# EAGLE schematic knxhome-lqfp32 (EAGLE 9.3.1)
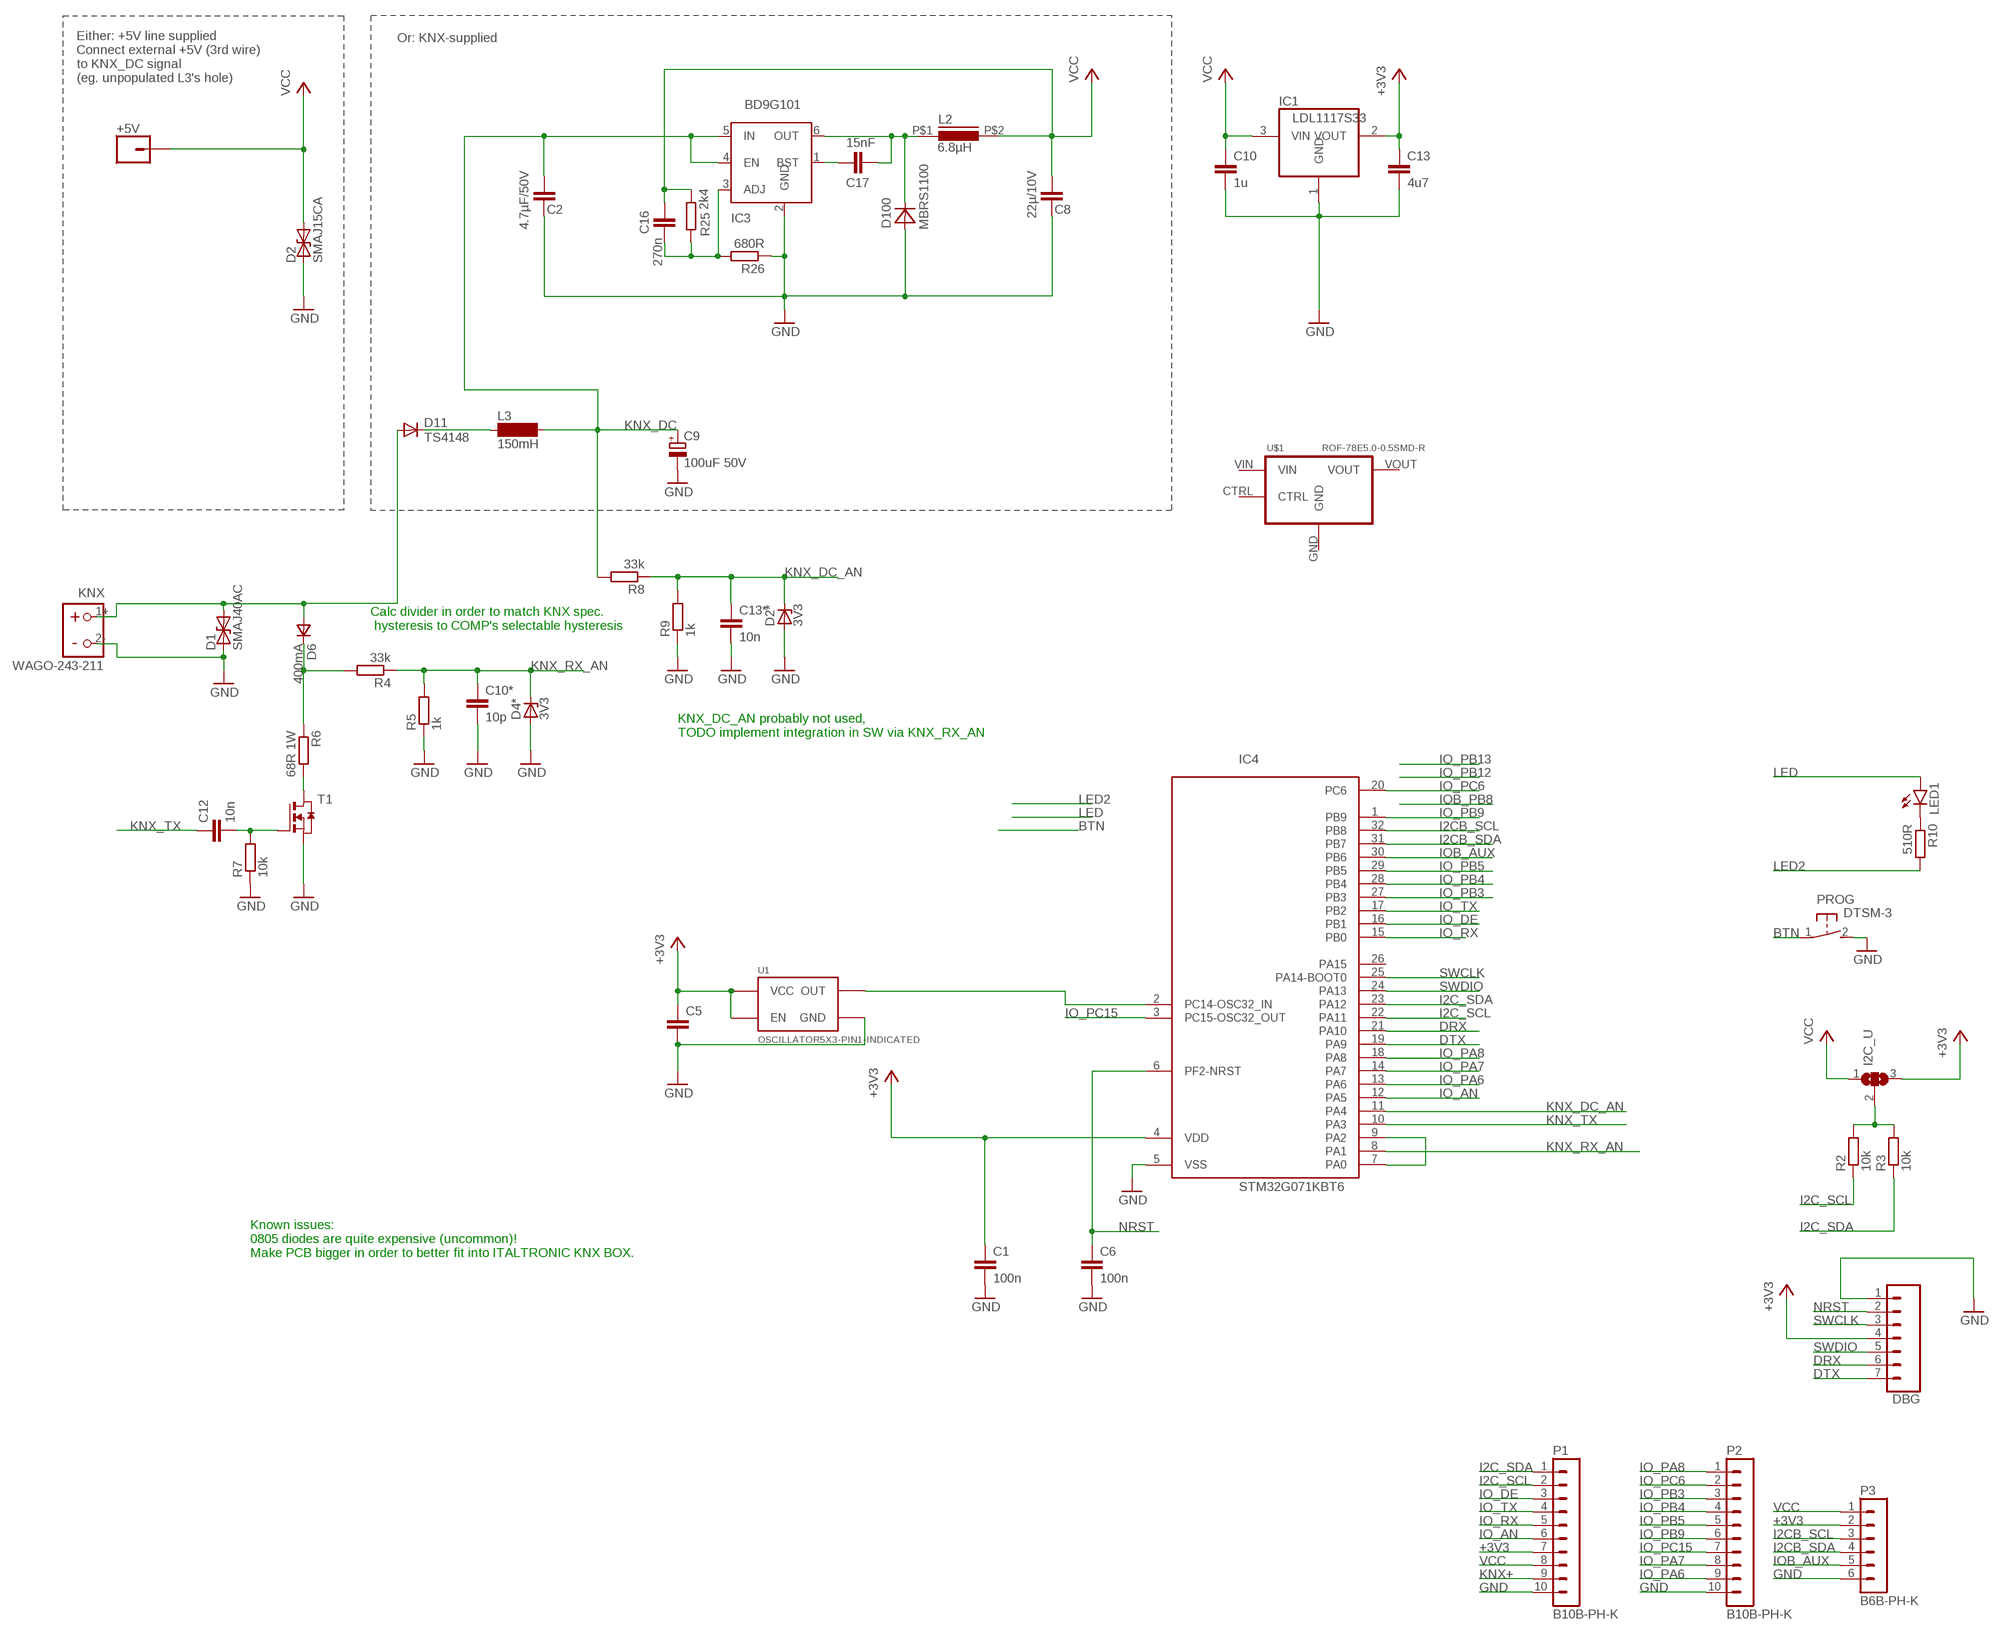
[diagram p0: schematic, sheet 1]

## Parts
+5V  CONN_01PTH_LONGPAD  [1X01_LONGPAD]
C1  100n  C-EUC0805  [C0805]
C2  4.7µF/50V  C-EUC0805  [C0805]
C5  C-EUC0805  [C0805]
C6  100n  C-EUC0805  [C0805]
C8  22µ/10V  C-EUC0805  [C0805]
C9  100uF 50V  CPOL-EUE3.5-8  [E3,5-8]
C10  1u  C-EUC0805  [C0805]
C10*  10p  C-EUC0805  [C0805]
C12  10n  C-EUC0805  [C0805]
C13  4u7  C-EUC0805  [C0805]
C13*  10n  C-EUC0805  [C0805]
C16  270n  C-EUC0805  [C0805]
C17  15nF  C-EUC0805  [C0805]
D1  SMAJ40AC  [DO-214AC]
D2  SMAJ15CA  SMAJ40AC  [DO-214AC]
D2*  3V3  ZENER-DIODESOT23  [SOT23]
D4*  3V3  ZENER-DIODESOT23  [SOT23]
D6  400mA  DSOD323  [SOD323]
D11  TS4148  DIODE-D0805  [D0805]
D100  MBRS1100  MBRA340T3  [SMA]
DBG  CONN_07LOCK  [1X07_LOCK]
I2C_U  SJ2W  [SJ_2]
IC1  LDL1117S33  REG1117  [SOT223]
IC3  BD9G101  BD9G101GBD9G101G-SOT23-6  [SOT23-6]
IC4  STM32G071KBT6  [LQFP32]
KNX  WAGO-243-211  [WAGO-243-211]
L2  6.8µH  IND_FASTRON_1616FPS  [PIS2812]
L3  150mH  SD12BS11_LIEGEND  [BS11_LIEGEND]
LED1  LEDCHIP-LED0805  [CHIP-LED0805]
P1  B10B-PH-K  [B10B-PH-K]
P2  B10B-PH-K  [B10B-PH-K]
P3  B6B-PH-K  [B6B-PH-K]
PROG  DTSM-3  [DTSM-3]
R2  10k  R-EU_R0805  [R0805]
R3  10k  R-EU_R0805  [R0805]
R4  33k  R-EU_R0805  [R0805]
R5  1k  R-EU_R0805  [R0805]
R6  68R 1W  R-EU_R2512  [R2512]
R7  10k  R-EU_R0805  [R0805]
R8  33k  R-EU_R0805  [R0805]
R9  1k  R-EU_R0805  [R0805]
R10  510R  R-EU_R0805  [R0805]
R25  2k4  R-EU_R0805  [R0805]
R26  680R  R-EU_R0805  [R0805]
T1  NMOSSOT23  [SOT-23]
U1  OSCILLATOR5X3-PIN1-INDICATED  [CRYSTAL-OSC-SMD-5X3]
U$1  ROF-78E5.0-0.5SMD-R  [ROF-78EX-XSMD-R]

## Nets
+3V3: C1.1 C5.1 C13.1 DBG.4 I2C_U.3 IC1.2(VOUT) IC4.4(VDD) P1.7 P3.2 U1.1(EN) U1.4(VCC)
ADJ: C16.1 IC3.3(ADJ) R25.1 R26.2
BTN: PROG.1
DRX: DBG.6 IC4.21(PA10)
DTX: DBG.7 IC4.19(PA9)
GND: C1.2 C2.1 C5.2 C6.2 C8.1 C9.- C10*.2 C10.2 C13*.2 C13.2 D1.A D2*.1(A) D2.A D4*.1(A) D100.A DBG.1 IC1.1(GND) IC3.2(GND) IC4.5(VSS) KNX.2- P1.10 P2.10 P3.6 PROG.2 R5.1 R7.1 R9.1 R26.1 T1.2(S) U1.2(GND)
I2C_PUP: I2C_U.2 R2.2 R3.2
I2C_SCL: IC4.22(PA11) P1.2 R2.1
I2C_SDA: IC4.23(PA12) P1.1 R3.1
I2CB_SCL: IC4.32(PB8) P3.3
I2CB_SDA: IC4.31(PB7) P3.4
IO_AN: IC4.12(PA5) P1.6
IO_DE: IC4.16(PB1) P1.3
IO_PA6: IC4.13(PA6) P2.9
IO_PA7: IC4.14(PA7) P2.8
IO_PA8: IC4.18(PA8) P2.1
IO_PB3: IC4.27(PB3) P2.3
IO_PB4: IC4.28(PB4) P2.4
IO_PB5: IC4.29(PB5) P2.5
IO_PB9: IC4.1(PB9) P2.6
IO_PC6: IC4.20(PC6) P2.2
IO_PC15: IC4.3(PC15-OSC32_OUT) P2.7
IO_RX: IC4.15(PB0) P1.5
IO_TX: IC4.17(PB2) P1.4
IOB_AUX: IC4.30(PB6) P3.5
KNX+ [power]: D1.C D6.2(A) D11.A KNX.1+ P1.9
KNX_DC: C2.2 C9.+ IC3.4(EN) IC3.5(IN) L3.2 R8.2
KNX_DC_AN: C13*.1 D2*.3(C) IC4.11(PA4) R8.1 R9.2
KNX_RECT: D6.1(C) R4.2 R6.1
KNX_RX_AN: C10*.1 D4*.3(C) IC4.8(PA1) R4.1 R5.2
KNX_TX: C12.1 IC4.10(PA3)
LED: LED1.A
LED2: R10.2
LX: C17.1 D100.C IC3.6(OUT) L2.P$1
N$1: D11.C L3.1
N$4: LED1.C R10.1
N$5: IC4.7(PA0) IC4.9(PA2)
N$7: R6.2 T1.1(D)
N$8: C12.2 R7.2 T1.3(G)
N$19: C17.2 IC3.1(BST)
NRST: C6.1 DBG.2 IC4.6(PF2-NRST)
OSC: IC4.2(PC14-OSC32_IN) U1.3(OUT)
SWCLK: DBG.3 IC4.25(PA14-BOOT0)
SWDIO: DBG.5 IC4.24(PA13)
VCC: +5V.1 C8.2 C10.1 C16.2 D2.C I2C_U.1 IC1.3(VIN) L2.P$2 P1.8 P3.1 R25.2
Unconnected: IC4.26(PA15) U$1.CTRL U$1.GND U$1.VIN U$1.VOUT

## Notes on the sheet
- Or: KNX-supplied
- Either: +5V line supplied
  Connect external +5V (3rd wire)
  to KNX_DC signal 
  (eg. unpopulated L3's hole)
- Calc divider in order to match KNX spec.
   hysteresis to COMP's selectable hysteresis
- KNX_DC_AN probably not used,
  TODO implement integration in SW via KNX_RX_AN
- Known issues:
  0805 diodes are quite expensive (uncommon)!
  Make PCB bigger in order to better fit into ITALTRONIC KNX BOX.

## Library data of the parts
+5V = SparkFun-Connectors:CONN_01: Single connection point. Often used as Generic Header-pin footprint for 0.1 inch spaced/style header connections On any of the 0.1 inch spaced packages, you can populate with these: Break Away Headers - Straight <https://www.sparkfun.com/products/116> (PRT-00116) Break Away Male Headers - Right Angle <https://www.sparkfun.com/products/553> (PRT-00553) Female Headers <https://www.sparkfun.com/products/115> (PRT-00115) Break Away Headers - Machine Pin <https://www.sparkfun.com/products/117> (PRT-00117) Break Away Female Headers - Swiss Machine Pin <https://www.sparkfun.com/products/743> (PRT-00743) This device is also useful as a general connection point to wire up your design to another part of your project. Our various solder wires solder well into these plated through hole pads. Hook-Up Wire - Assortment (Stranded, 22 AWG) <https://www.sparkfun.com/products/11375> (PRT-11375) Hook-Up Wire - Assortment (Solid Core, 22 AWG) <https://www.sparkfun.com/products/11367> (PRT-11367) View the entire wire category on our website here <https://www.sparkfun.com/categories/141> Special notes: SMTSO-256-ET is a "flush mount" nut for a 4-40 screw. We mostly use this on specialty testbeds; it is a nice way to connect hardware to your PCB at an adjustable hieght. Also note, the SNAP packages are for using a snappable style connector. We sell a baggie of snaps and they are also used on two LilyPad designs: Snap Assortment - 30 pack (male and female) <https://www.sparkfun.com/products/11347> (DEV-11347) LilyPad Arduino SimpleSnap <https://www.sparkfun.com/products/10941> (DEV-10941) LilyPad SimpleSnap Protoboard <https://www.sparkfun.com/products/10940> (DEV-10940)
C1 C2 C5 C6 C8 C10 C10* C12 C13 C13* C16 C17 = rcl:C-EU: CAPACITOR, European symbol; SPICEPREFIX: C
C9 = rcl:CPOL-EU: POLARIZED CAPACITOR, European symbol
D1 D2 = diode:SMAJ40AC
D2* D4* = diode:ZENER-DIODE: Z-Diode
D6 = zetex:D: DIODE; MPN: CDSOD323-T05C; OC_FARNELL: 1824860; OC_NEWARK: 79R6078
D11 = diode:DIODE-: DIODE
D100 = diode:MBRA340T3: Surface Mount Schottky Power Rectifier Source: http://www.onsemi.com/pub_link/Collateral/MBRA340T3-D.PDF; REICHELT: MBRS 1100 SMD
DBG = SparkFun-Connectors:CONN_07: Multi connection point. Often used as Generic Header-pin footprint for 0.1 inch spaced/style header connections On any of the 0.1 inch spaced packages, you can populate with these: Break Away Headers - Straight <https://www.sparkfun.com/products/116> (PRT-00116) Break Away Male Headers - Right Angle <https://www.sparkfun.com/products/553> (PRT-00553) Female Headers <https://www.sparkfun.com/products/115> (PRT-00115) Break Away Headers - Machine Pin <https://www.sparkfun.com/products/117> (PRT-00117) Break Away Female Headers - Swiss Machine Pin <https://www.sparkfun.com/products/743> (PRT-00743) For SCREWTERMINALS and SPRING TERMINALS visit here: Screw Terimnals on SparkFun.com <https://www.sparkfun.com/search/results?term=Screw+Terminals> (5mm/3.5mm/2.54mm spacing) This device is also useful as a general connection point to wire up your design to another part of your project. Our various solder wires solder well into these plated through hole pads. Hook-Up Wire - Assortment (Stranded, 22 AWG) <https://www.sparkfun.com/products/11375> (PRT-11375) Hook-Up Wire - Assortment (Solid Core, 22 AWG) <https://www.sparkfun.com/products/11367> (PRT-11367) View the entire wire category on our website here <https://www.sparkfun.com/categories/141> Special notes: Molex polarized connector foot print use with SKU : PRT-08231 with associated crimp pins and housings. 1MM SMD Version SKU: PRT-10208 NOTES ON THE VARIANTS LOCK and LOCK_LONGPADS... This footprint was designed to help hold the alignment of a through-hole component (i.e. 6-pin header) while soldering it into place. You may notice that each hole has been shifted either up or down by 0.005 of an inch from it's more standard position (which is a perfectly straight line). This slight alteration caused the pins (the squares in the middle) to touch the edges of the holes. Because they are alternating, it causes a "brace" to hold the component in place. 0.005 has proven to be the perfect amount of "off-center" position when using our standard breakaway headers. Although looks a little odd when you look at the bare footprint, once you have a header in there, the alteration is very hard to notice. Also,if you push a header all the way into place, it is covered up entirely on the bottom side.
I2C_U = jumper:SJ2W: SMD solder JUMPER
IC1 = burr-brown:REG1117: 800mA and 1A Low Dropout (LDO) Positive Regulator 1.8V, 2.5V, 2.85V, 3.3V, 5V, and Adj; MPN: REG1117; OC_FARNELL: 1097566; OC_NEWARK: 14P6981
IC3 = Stefan_selfbus:BD9G101G
IC4 = stm32g0:STM32G071KBT
KNX = Connector_for_Selfbus-Projects:WAGO-243-211: WAGO KNX-Busklemme
L2 = Stefan_selfbus:IND_FASTRON_1616FPS
L3 = inductor-neosid:SD12: INDUCTOR nominal inductance
LED1 = led:LED: LED OSRAM: - CHIPLED LG R971, LG N971, LY N971, LG Q971, LY Q971, LO R971, LY R971 LH N974, LH R974 LS Q976, LO Q976, LY Q976 LO Q996 - Hyper CHIPLED LW Q18S LB Q993, LB Q99A, LB R99A - SideLED LS A670, LO A670, LY A670, LG A670, LP A670 LB A673, LV A673, LT A673, LW A673 LH A674 LY A675 LS A676, LA A676, LO A676, LY A676, LW A676 LS A679, LY A679, LG A679 - Hyper Micro SIDELED® LS Y876, LA Y876, LO Y876, LY Y876 LT Y87S - SmartLED LW L88C, LW L88S LB L89C, LB L89S, LG L890 LS L89K, LO L89K, LY L89K LS L896, LA L896, LO L896, LY L896 - TOPLED LS T670, LO T670, LY T670, LG T670, LP T670 LSG T670, LSP T670, LSY T670, LOP T670, LYG T670 LG T671, LOG T671, LSG T671 LB T673, LV T673, LT T673, LW T673 LH T674 LS T676, LA T676, LO T676, LY T676, LB T676, LH T676, LSB T676, LW T676 LB T67C, LV T67C, LT T67C, LS T67K, LO T67K, LY T67K, LW E67C LS E67B, LA E67B, LO E67B, LY E67B, LB E67C, LV E67C, LT E67C LW T67C LS T679, LY T679, LG T679 LS T770, LO T770, LY T770, LG T770, LP T770 LB T773, LV T773, LT T773, LW T773 LH T774 LS E675, LA E675, LY E675, LS T675 LS T776, LA T776, LO T776, LY T776, LB T776 LHGB T686 LT T68C, LB T68C - Hyper Mini TOPLED® LB M676 - Mini TOPLED Santana® LG M470 LS M47K, LO M47K, LY M47K Source: http://www.osram.convergy.de LUXEON: - LUMILED® LXK2-PW12-R00, LXK2-PW12-S00, LXK2-PW14-U00, LXK2-PW14-V00 LXK2-PM12-R00, LXK2-PM12-S00, LXK2-PM14-U00 LXK2-PE12-Q00, LXK2-PE12-R00, LXK2-PE12-S00, LXK2-PE14-T00, LXK2-PE14-U00 LXK2-PB12-K00, LXK2-PB12-L00, LXK2-PB12-M00, LXK2-PB14-N00, LXK2-PB14-P00, LXK2-PB14-Q00 LXK2-PR12-L00, LXK2-PR12-M00, LXK2-PR14-Q00, LXK2-PR14-R00 LXK2-PD12-Q00, LXK2-PD12-R00, LXK2-PD12-S00 LXK2-PH12-R00, LXK2-PH12-S00 LXK2-PL12-P00, LXK2-PL12-Q00, LXK2-PL12-R00 Source: www.luxeon.com KINGBRIGHT: KA-3528ASYC Source: www.kingbright.com
P1 P2 = con-jst-ph:B10B-PH-K: HEADER
P3 = con-jst-ph:B6B-PH-K: HEADER
PROG = switch-tact:DTSM-3
R2-R10 R25 R26 = rcl:R-EU_: RESISTOR, European symbol; SPICEPREFIX: R
T1 = zetex:NMOSSOT23: MOS FET; OC_FARNELL: unknown; OC_NEWARK: unknown
U1 = SparkFun-FreqCtrl:OSCILLATOR: Generic 5x3 and 7x5 oscillators
U$1 = rof-78e:ROF-78E5.0-0.5SMD-R

## Net classes
1 power: width 0.305 mm